# EAGLE design SkinProc_v0_1b_sensors (EAGLE 7.2.0)
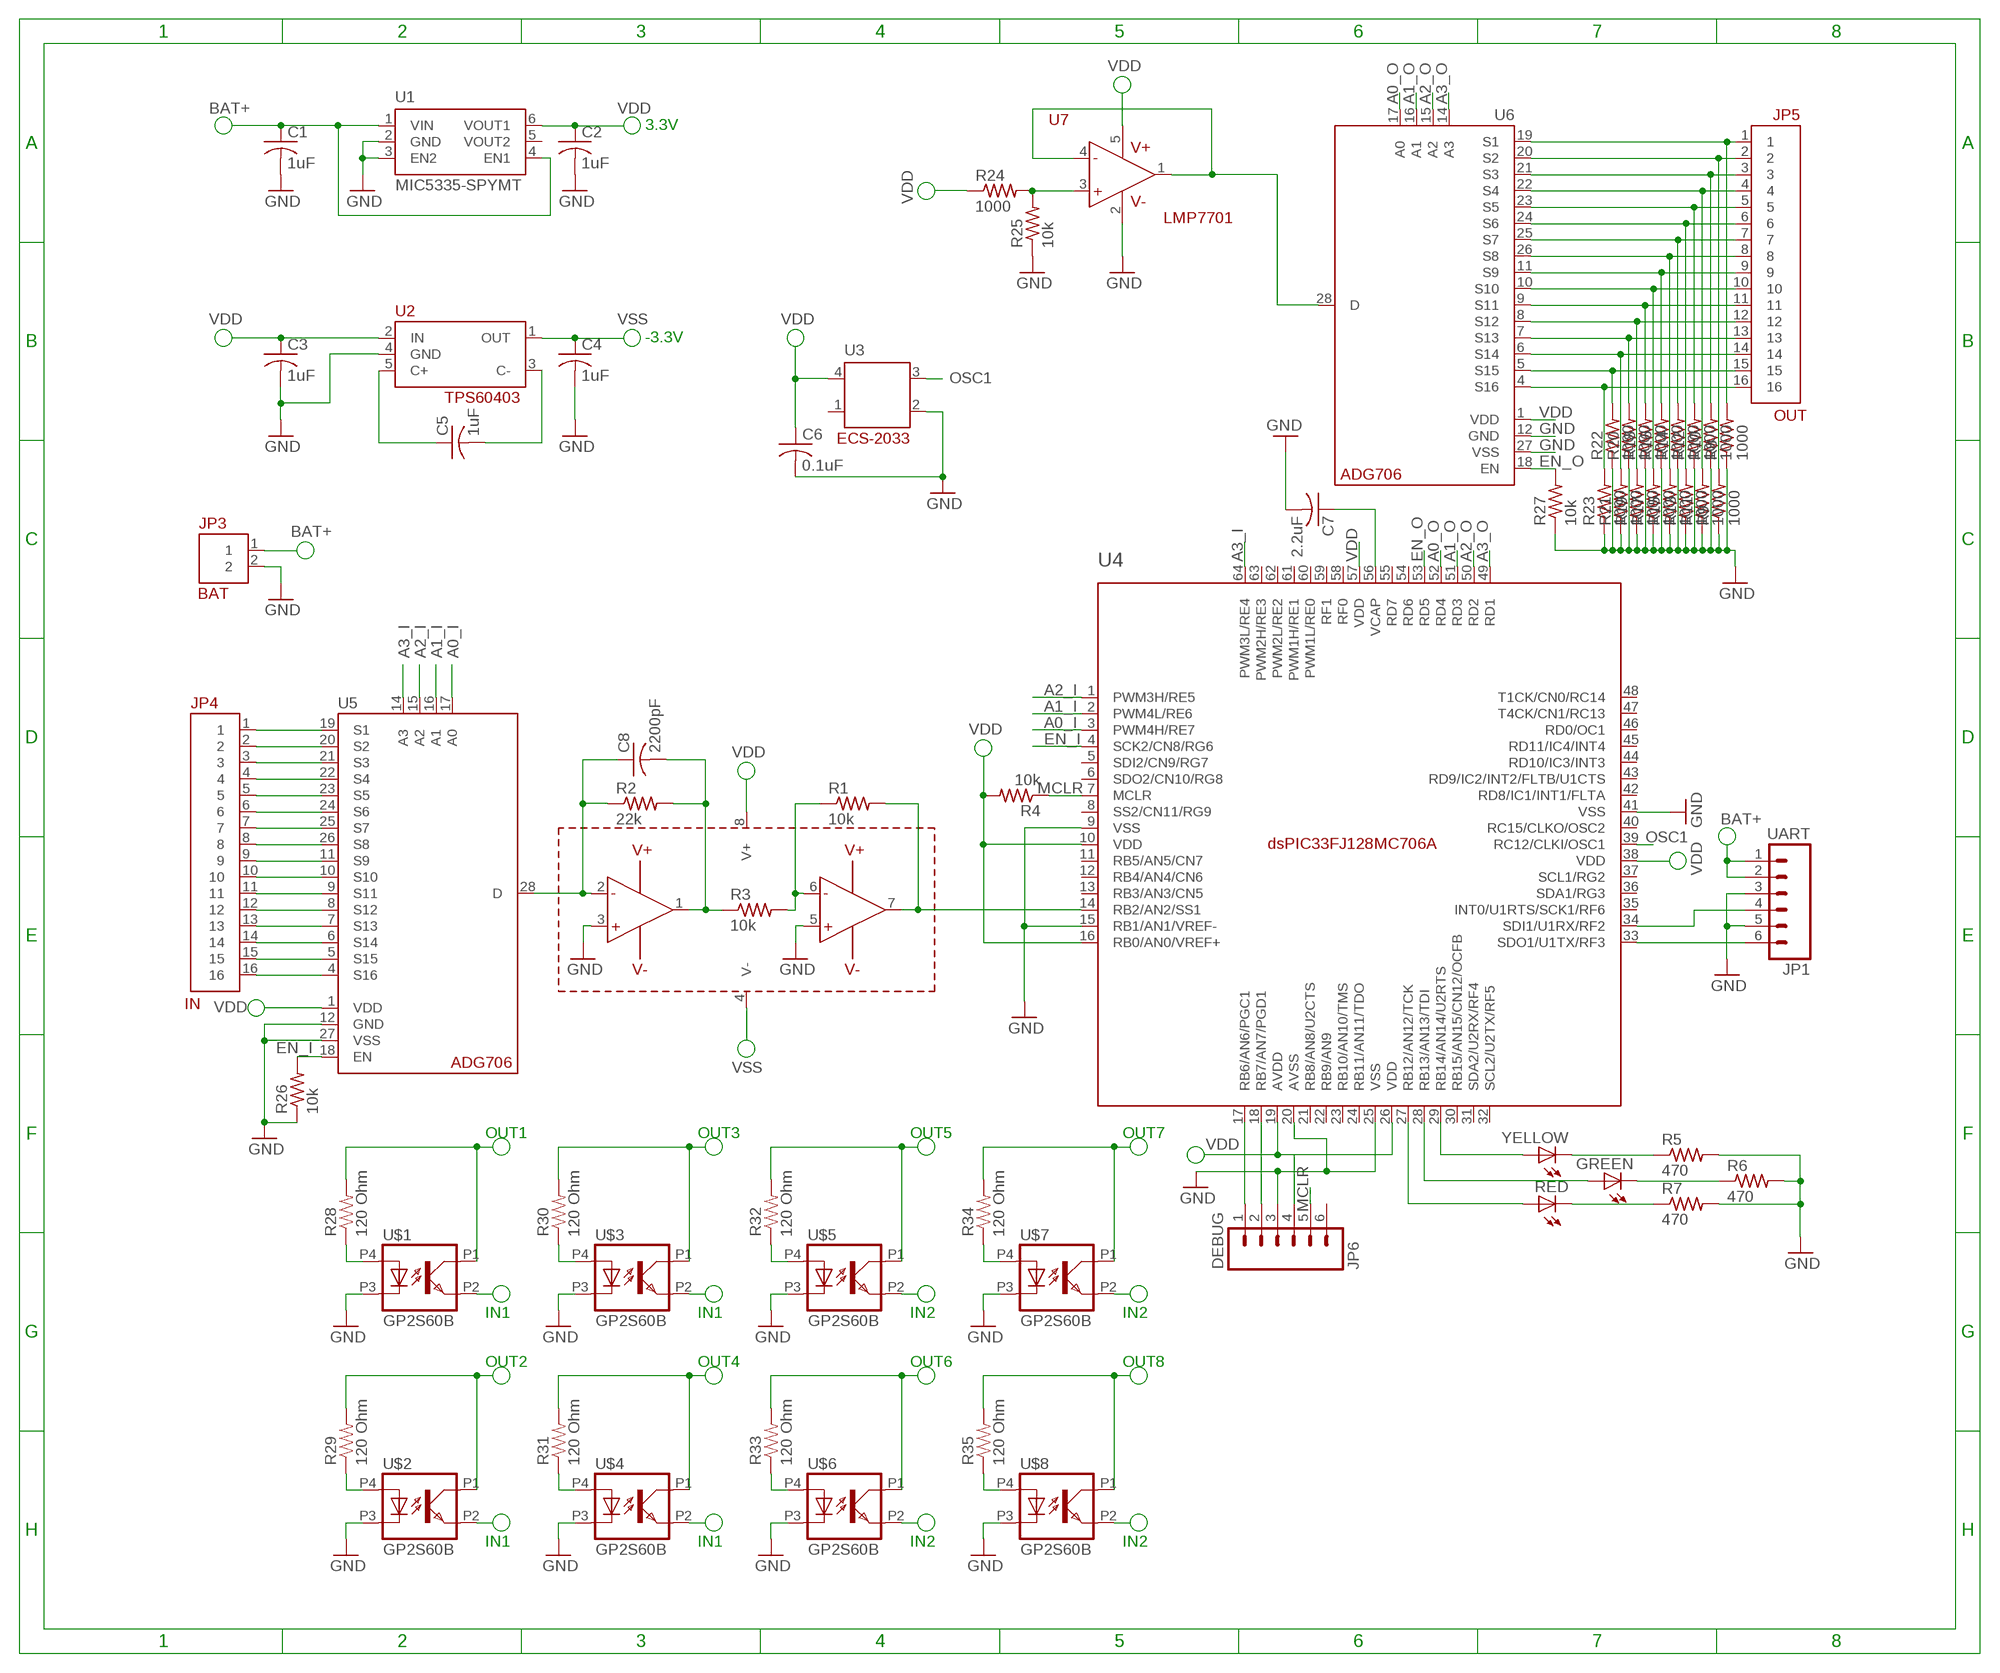
[diagram p0: schematic, sheet 1]

## Parts
C1  1uF  C-USC0402  [C0402]
C2  1uF  C-USC0402  [C0402]
C3  1uF  C-USC0402  [C0402]
C4  1uF  C-USC0402  [C0402]
C5  1uF  C-USC0402  [C0402]
C6  0.1uF  C-USC0402  [C0402]
C7  2.2uF  C-USC0402  [C0402]
C8  2200pF  C-USC0402  [C0402]
GREEN  LEDCHIP-LED0603  [CHIP-LED0603]
JP1  UART  MOLEX_503480-0600  [MOLEX_503480-0600]
JP3  BAT  2_PAD  [2_PAD]
JP4  IN  16_PAD  [16_PAD]
JP5  OUT  16_PAD  [16_PAD]
JP6  DEBUG  MOLEX_503480-0600  [MOLEX_503480-0600]
R1  10k  R-US_R0402  [R0402]
R2  22k  R-US_R0402  [R0402]
R3  10k  R-US_R0402  [R0402]
R4  10k  R-US_R0402  [R0402]
R5  470  R-US_R0402  [R0402]
R6  470  R-US_R0402  [R0402]
R7  470  R-US_R0402  [R0402]
R8  1000  R-US_R0402  [R0402]
R9  1000  R-US_R0402  [R0402]
R10  1000  R-US_R0402  [R0402]
R11  1000  R-US_R0402  [R0402]
R12  1000  R-US_R0402  [R0402]
R13  1000  R-US_R0402  [R0402]
R14  1000  R-US_R0402  [R0402]
R15  1000  R-US_R0402  [R0402]
R16  1000  R-US_R0402  [R0402]
R17  1000  R-US_R0402  [R0402]
R18  1000  R-US_R0402  [R0402]
R19  1000  R-US_R0402  [R0402]
R20  1000  R-US_R0402  [R0402]
R21  1000  R-US_R0402  [R0402]
R22  1000  R-US_R0402  [R0402]
R23  1000  R-US_R0402  [R0402]
R24  1000  R-US_R0402  [R0402]
R25  10k  R-US_R0402  [R0402]
R26  10k  R-US_R0402  [R0402]
R27  10k  R-US_R0402  [R0402]
R28  120 Ohm  RESISTOR0402-RES  [0402-RES]
R29  120 Ohm  RESISTOR0402-RES  [0402-RES]
R30  120 Ohm  RESISTOR0402-RES  [0402-RES]
R31  120 Ohm  RESISTOR0402-RES  [0402-RES]
R32  120 Ohm  RESISTOR0402-RES  [0402-RES]
R33  120 Ohm  RESISTOR0402-RES  [0402-RES]
R34  120 Ohm  RESISTOR0402-RES  [0402-RES]
R35  120 Ohm  RESISTOR0402-RES  [0402-RES]
RED  LEDCHIP-LED0603  [CHIP-LED0603]
U1  MIC5335-SPYMT  MIC5320-JGYML  [MLF-6]
U2  TPS60403  [SOT23-DBV]
U3  OSCILLATORS  [OSCILLATOR-SMD]
U4  DSPIC33FJ128MC706-I/PT  [TQFP64]
U5  ADG706  [TSSOP28]
U6  ADG706  [TSSOP28]
U7  LMP7701  NATIONAL_OP_AMP_SINGLE  [SOT23-DBV]
U8  NATIONAL_OP_AMP  [SO08]
U$1  GP2S60B  [4-SMD]
U$2  GP2S60B  [4-SMD]
U$3  GP2S60B  [4-SMD]
U$4  GP2S60B  [4-SMD]
U$5  GP2S60B  [4-SMD]
U$6  GP2S60B  [4-SMD]
U$7  GP2S60B  [4-SMD]
U$8  GP2S60B  [4-SMD]
YELLOW  LEDCHIP-LED0603  [CHIP-LED0603]

## Nets
A0_I: U4.3(PWM4H/RE7) U5.17(A0)
A0_O: U4.52(RD4) U6.17(A0)
A1_I: U4.2(PWM4L/RE6) U5.16(A1)
A1_O: U4.51(RD3) U6.16(A1)
A2_I: U4.1(PWM3H/RE5) U5.15(A2)
A2_O: U4.50(RD2) U6.15(A2)
A3_I: U4.64(PWM3L/RE4) U5.14(A3)
A3_O: U4.49(RD1) U6.14(A3)
BAT+: C1.1 JP1.1 JP1.2 JP3.1 U1.1(VIN) U1.4(EN1)
EN_I: R26.2 U4.4(SCK2/CN8/RG6) U5.18(EN)
EN_O: R27.2 U4.53(RD5) U6.18(EN)
GND: C1.2 C2.2 C3.2 C4.2 C6.2 C7.2 JP1.3 JP1.5 JP3.2 JP6.3 R5.2 R6.2 R7.2 R8.1 R9.1 R10.1 R11.1 R12.1 R13.1 R14.1 R15.1 R16.1 R17.1 R18.1 R19.1 R20.1 R21.1 R22.1 R23.1 R25.1 R26.1 R27.1 U1.2(GND) U1.3(EN2) U2.4(GND) U3.2(GND) U4.9(VSS) U4.15(RB1/AN1/VREF-) U4.20(AVSS) U4.25(VSS) U4.41(VSS) U5.12(GND) U5.27(VSS) U6.12(GND) U6.27(VSS) U7.2(V-) U8.3(+A) U8.5(+B) U$1.P3 U$2.P3 U$3.P3 U$4.P3 U$5.P3 U$6.P3 U$7.P3 U$8.P3
IN1: JP4.1 U5.19(S1) U$1.P2 U$2.P2 U$3.P2 U$4.P2
IN2: JP4.2 U5.20(S2) U$5.P2 U$6.P2 U$7.P2 U$8.P2
IN3: JP4.3 U5.21(S3)
IN4: JP4.4 U5.22(S4)
IN5: JP4.5 U5.23(S5)
IN6: JP4.6 U5.24(S6)
IN7: JP4.7 U5.25(S7)
IN8: JP4.8 U5.26(S8)
IN9: JP4.9 U5.11(S9)
IN10: JP4.10 U5.10(S10)
IN11: JP4.11 U5.9(S11)
IN12: JP4.12 U5.8(S12)
IN13: JP4.13 U5.7(S13)
IN14: JP4.14 U5.6(S14)
IN15: JP4.15 U5.5(S15)
IN16: JP4.16 U5.4(S16)
MCLR: JP6.5 R4.1 U4.7(MCLR)
N$1: R1.2 U4.14(RB2/AN2/SS1) U8.7(VOUTB)
N$2: C5.1 U2.5(C+)
N$3: C7.1 U4.56(VCAP)
N$4: C5.2 U2.3(C-)
N$5: R5.1 YELLOW.C
N$6: R28.1 U$1.P4
N$7: JP6.1 U4.17(RB6/AN6/PGC1)
N$8: R1.1 R3.2 U8.6(-B)
N$9: C8.2 R2.2 R3.1 U8.1(VOUTA)
N$10: JP6.2 U4.18(RB7/AN7/PGD1)
N$11: C8.1 R2.1 U5.28(D) U8.2(-A)
N$12: JP1.4 U4.34(SDI1/U1RX/RF2)
N$13: JP1.6 U4.33(SDO1/U1TX/RF3)
N$14: R7.1 RED.C
N$15: GREEN.C R6.1
N$16: U4.29(RB14/AN14/U2RTS) YELLOW.A
N$17: GREEN.A U4.28(RB13/AN13/TDI)
N$18: RED.A U4.27(RB12/AN12/TCK)
N$19: R29.1 U$2.P4
N$20: R30.1 U$3.P4
N$21: R31.1 U$4.P4
N$23: U6.28(D) U7.1(VOUT) U7.4(-)
N$25: R32.1 U$5.P4
N$26: R33.1 U$6.P4
N$27: R34.1 U$7.P4
N$28: R35.1 U$8.P4
N$30: R24.2 R25.2 U7.3(+)
OSC1: U3.3(OUT) U4.39(RC12/CLKI/OSC1)
OUT1: JP5.1 R8.2 R28.2 U6.19(S1) U$1.P1
OUT2: JP5.2 R9.2 R29.2 U6.20(S2) U$2.P1
OUT3: JP5.3 R10.2 R30.2 U6.21(S3) U$3.P1
OUT4: JP5.4 R11.2 R31.2 U6.22(S4) U$4.P1
OUT5: JP5.5 R12.2 R32.2 U6.23(S5) U$5.P1
OUT6: JP5.6 R13.2 R33.2 U6.24(S6) U$6.P1
OUT7: JP5.7 R14.2 R34.2 U6.25(S7) U$7.P1
OUT8: JP5.8 R15.2 R35.2 U6.26(S8) U$8.P1
OUT9: JP5.9 R16.2 U6.11(S9)
OUT10: JP5.10 R17.2 U6.10(S10)
OUT11: JP5.11 R18.2 U6.9(S11)
OUT12: JP5.12 R19.2 U6.8(S12)
OUT13: JP5.13 R20.2 U6.7(S13)
OUT14: JP5.14 R21.2 U6.6(S14)
OUT15: JP5.15 R22.2 U6.5(S15)
OUT16: JP5.16 R23.2 U6.4(S16)
VDD: C2.1 C3.1 C6.1 JP6.4 R4.2 R24.1 U1.6(VOUT1) U2.2(IN) U3.4(VDD) U4.10(VDD) U4.16(RB0/AN0/VREF+) U4.19(AVDD) U4.26(VDD) U4.38(VDD) U4.57(VDD) U5.1(VDD) U6.1(VDD) U7.5(V+) U8.8(V+)
VSS: C4.1 U2.1(OUT) U8.4(V-)
Unconnected: JP6.6 U1.5(VOUT2) U3.1(NC) U4.5(SDI2/CN9/RG7) U4.6(SDO2/CN10/RG8) U4.8(SS2/CN11/RG9) U4.11(RB5/AN5/CN7) U4.12(RB4/AN4/CN6) U4.13(RB3/AN3/CN5) U4.21(RB8/AN8/U2CTS) U4.22(RB9/AN9) U4.23(RB10/AN10/TMS) U4.24(RB11/AN11/TDO) U4.30(RB15/AN15/CN12/OCFB) U4.31(SDA2/U2RX/RF4) U4.32(SCL2/U2TX/RF5) U4.35(INT0/U1RTS/SCK1/RF6) U4.36(SDA1/RG3) U4.37(SCL1/RG2) U4.40(RC15/CLKO/OSC2) U4.42(RD8/IC1/INT1/FLTA) U4.43(RD9/IC2/INT2/FLTB/U1CTS) U4.44(RD10/IC3/INT3) U4.45(RD11/IC4/INT4) U4.46(RD0/OC1) U4.47(T4CK/CN1/RC13) U4.48(T1CK/CN0/RC14) U4.54(RD6) U4.55(RD7) U4.58(RF0) U4.59(RF1) U4.60(PWM1L/RE0) U4.61(PWM1H/RE1) U4.62(PWM2L/RE2) U4.63(PWM2H/RE3)

## Notes on the sheet
- 3.3V
- -3.3V
- OUT1 | OUT3 | OUT5 | OUT7
- IN1 | IN1 | IN2 | IN2
- OUT2 | OUT4 | OUT6 | OUT8
- IN1 | IN1 | IN2 | IN2

## Library data of the parts
C1-C8 = rcl:C-US: CAPACITOR, American symbol
GREEN RED YELLOW = led:LED: LED OSRAM: - CHIPLED LG R971, LG N971, LY N971, LG Q971, LY Q971, LO R971, LY R971 LH N974, LH R974 LS Q976, LO Q976, LY Q976 LO Q996 - Hyper CHIPLED LW Q18S LB Q993, LB Q99A, LB R99A - SideLED LS A670, LO A670, LY A670, LG A670, LP A670 LB A673, LV A673, LT A673, LW A673 LH A674 LY A675 LS A676, LA A676, LO A676, LY A676, LW A676 LS A679, LY A679, LG A679 - Hyper Micro SIDELED® LS Y876, LA Y876, LO Y876, LY Y876 LT Y87S - SmartLED LW L88C, LW L88S LB L89C, LB L89S, LG L890 LS L89K, LO L89K, LY L89K LS L896, LA L896, LO L896, LY L896 - TOPLED LS T670, LO T670, LY T670, LG T670, LP T670 LSG T670, LSP T670, LSY T670, LOP T670, LYG T670 LG T671, LOG T671, LSG T671 LB T673, LV T673, LT T673, LW T673 LH T674 LS T676, LA T676, LO T676, LY T676, LB T676, LH T676, LSB T676, LW T676 LB T67C, LV T67C, LT T67C, LS T67K, LO T67K, LY T67K, LW E67C LS E67B, LA E67B, LO E67B, LY E67B, LB E67C, LV E67C, LT E67C LW T67C LS T679, LY T679, LG T679 LS T770, LO T770, LY T770, LG T770, LP T770 LB T773, LV T773, LT T773, LW T773 LH T774 LS E675, LA E675, LY E675, LS T675 LS T776, LA T776, LO T776, LY T776, LB T776 LHGB T686 LT T68C, LB T68C - Hyper Mini TOPLED® LB M676 - Mini TOPLED Santana® LG M470 LS M47K, LO M47K, LY M47K Source: http://www.osram.convergy.de LUXEON: - LUMILED® LXK2-PW12-R00, LXK2-PW12-S00, LXK2-PW14-U00, LXK2-PW14-V00 LXK2-PM12-R00, LXK2-PM12-S00, LXK2-PM14-U00 LXK2-PE12-Q00, LXK2-PE12-R00, LXK2-PE12-S00, LXK2-PE14-T00, LXK2-PE14-U00 LXK2-PB12-K00, LXK2-PB12-L00, LXK2-PB12-M00, LXK2-PB14-N00, LXK2-PB14-P00, LXK2-PB14-Q00 LXK2-PR12-L00, LXK2-PR12-M00, LXK2-PR14-Q00, LXK2-PR14-R00 LXK2-PD12-Q00, LXK2-PD12-R00, LXK2-PD12-S00 LXK2-PH12-R00, LXK2-PH12-S00 LXK2-PL12-P00, LXK2-PL12-Q00, LXK2-PL12-R00 Source: www.luxeon.com KINGBRIGHT: KA-3528ASYC Source: www.kingbright.com
JP1 JP6 = biomimetic:MOLEX_503480-0600
JP3 = SkinProc:2_PAD
JP4 JP5 = SkinProc:16_PAD
R1-R27 = rcl:R-US_: RESISTOR, American symbol
R28-R35 = biomimetic:RESISTOR: Resistor Basic schematic elements and footprints for 0603, 1206, and PTH resistors.
U1 = stan:MIC5320: MIC5320 High Performance Dual 150mA Voltage Regulator Package: NOT VERIFIED
U2 = SkinProc:TPS60403
U3 = stan:OSCILLATOR
U4 = stan:DSPIC33FJ128MC706: Microchip dsPIC33FJ128MC706
U5 U6 = SkinProc:ADG706: Analog Devices ADG706 16:1 Analog Mux
U7 = SkinProc:NATIONAL_OP_AMP_SINGLE
U8 = SkinProc:NATIONAL_OP_AMP: National Semiconductor LM6144/LMP7702 OP AMP
U$1-U$8 = jgoldberg:GP2S60B

## Board
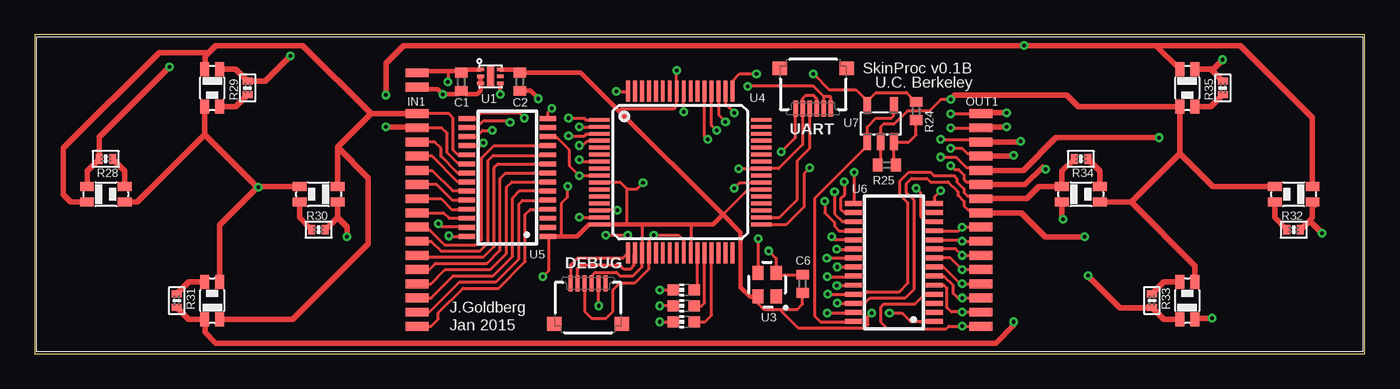
[diagram p1: board, top side]
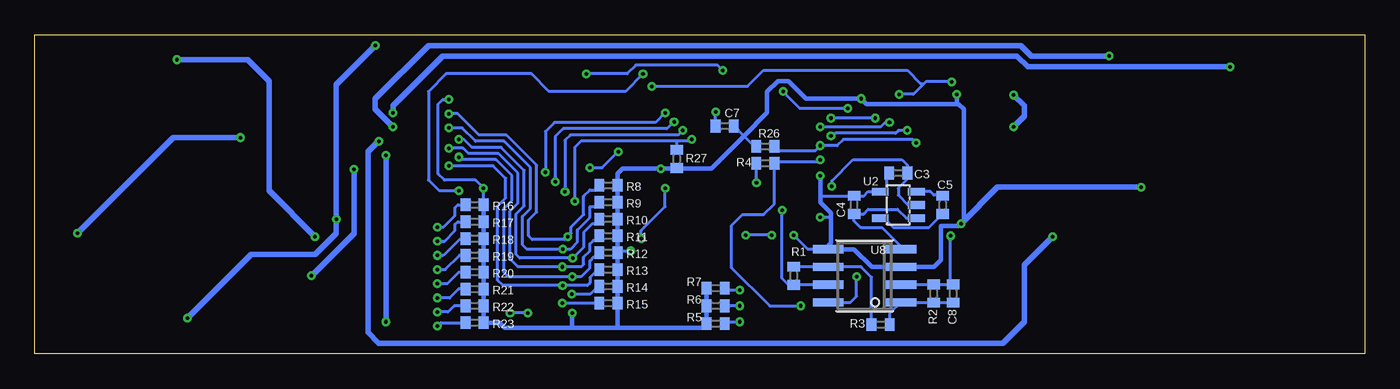
[diagram p2: board, bottom side, seen from below]

Size 95.25 x 22.86 mm. Coordinates in mm from the lower left corner, seen from the top.
Outline: 0,0 95.25,0 95.25,22.86 0,22.86 0,0
Copper layers (1*16): Top 2mil / dielectric 27mil / Bottom 2mil
Design rules "advancedcircuits-standard-biomimetic": minimum track width 5mil, minimum drill 10mil, track to track 5mil, track to pad 5mil, pad to pad 5mil, via to via 5mil, smd to smd 5mil, copper to edge 0.256540625mm, drill to drill 0.256540625mm, minimum pad ring 0.180340625mm, minimum via ring 0.180340625mm, stop-mask expansion 2mil, vias tented up to drill 0mil, thermal gap 10mil

### Footprints (pad centres in the part's own frame; a part is rotated, then mirrored left to right if it is on the bottom)
C0402 = smd 0.7 x 0.9: 1 -0.65,0; 2 0.65,0
CHIP-LED0603 = smd 0.8 x 0.8: A 0,-0.75; C 0,0.75
MOLEX_503480-0600 = smd 0.3 x 1.15: 1 -1.25,1.725; 2 -0.75,1.725; 3 -0.25,1.725; 4 0.25,1.725; 5 0.75,1.725; 6 1.25,1.725 | smd 1.035 x 1: L -2.408,-1.15; R 2.408,-1.15
2_PAD = smd 1.651 x 0.635: 1 0.953,1.46; 2 0.953,0.445
16_PAD = smd 1.651 x 0.635: 1 0.953,15.684; 2 0.953,14.668; 3 0.953,13.652; 4 0.953,12.636; 5 0.953,11.62; 6 0.953,10.604; 7 0.953,9.588; 8 0.953,8.572; 9 0.953,7.556; 10 0.953,6.54; 11 0.953,5.524; 12 0.953,4.508; 13 0.953,3.493; 14 0.953,2.477; 15 0.953,1.46; 16 0.953,0.445
R0402 = smd 0.7 x 0.9: 1 -0.65,0; 2 0.65,0
0402-RES = smd 0.508 x 0.711: 1 -0.483,0; 2 0.483,0
MLF-6 = smd 0.25 x 0.5: 1 -0.5,-0.7; 2 0,-0.7; 3 0.5,-0.7; 4 0.5,0.7; 5 0,0.7; 6 -0.5,0.7 | smd 1.4 x 0.5: P$1 0,0
SOT23-DBV = smd 0.55 x 1.2: 1 -0.95,-1.3; 2 0,-1.3; 3 0.95,-1.3; 4 0.95,1.3; 5 -0.95,1.3
OSCILLATOR-SMD = smd 1 x 0.8: 1 -0.85,-0.65; 2 0.85,-0.65; 3 0.85,0.65; 4 -0.85,0.65
TQFP64 = smd 1.5 x 0.28: 1 -5.8,3.75; 2 -5.8,3.25; 3 -5.8,2.75; 4 -5.8,2.25; 5 -5.8,1.75; 6 -5.8,1.25; 7 -5.8,0.75; 8 -5.8,0.25; 9 -5.8,-0.25; 10 -5.8,-0.75; 11 -5.8,-1.25; 12 -5.8,-1.75; 13 -5.8,-2.25; 14 -5.8,-2.75; 15 -5.8,-3.25; 16 -5.8,-3.75; 33 5.8,-3.75; 34 5.8,-3.25; 35 5.8,-2.75; 36 5.8,-2.25; 37 5.8,-1.75; 38 5.8,-1.25; 39 5.8,-0.75; 40 5.8,-0.25; 41 5.8,0.25; 42 5.8,0.75; 43 5.8,1.25; 44 5.8,1.75; 45 5.8,2.25; 46 5.8,2.75; 47 5.8,3.25; 48 5.8,3.75 | smd 0.28 x 1.5: 17 -3.75,-5.8; 18 -3.25,-5.8; 19 -2.75,-5.8; 20 -2.25,-5.8; 21 -1.75,-5.8; 22 -1.25,-5.8; 23 -0.75,-5.8; 24 -0.25,-5.8; 25 0.25,-5.8; 26 0.75,-5.8; 27 1.25,-5.8; 28 1.75,-5.8; 29 2.25,-5.8; 30 2.75,-5.8; 31 3.25,-5.8; 32 3.75,-5.8; 49 3.75,5.8; 50 3.25,5.8; 51 2.75,5.8; 52 2.25,5.8; 53 1.75,5.8; 54 1.25,5.8; 55 0.75,5.8; 56 0.25,5.8; 57 -0.25,5.8; 58 -0.75,5.8; 59 -1.25,5.8; 60 -1.75,5.8; 61 -2.25,5.8; 62 -2.75,5.8; 63 -3.25,5.8; 64 -3.75,5.8
TSSOP28 = smd 0.35 x 1.2: 1 -4.225,-2.9; 2 -3.575,-2.9; 3 -2.925,-2.9; 4 -2.275,-2.9; 5 -1.625,-2.9; 6 -0.975,-2.9; 7 -0.325,-2.9; 8 0.325,-2.9; 9 0.975,-2.9; 10 1.625,-2.9; 11 2.275,-2.9; 12 2.925,-2.9; 13 3.575,-2.9; 14 4.225,-2.9; 15 4.225,2.9; 16 3.575,2.9; 17 2.925,2.9; 18 2.275,2.9; 19 1.625,2.9; 20 0.975,2.9; 21 0.325,2.9; 22 -0.325,2.9; 23 -0.975,2.9; 24 -1.625,2.9; 25 -2.275,2.9; 26 -2.925,2.9; 27 -3.575,2.9; 28 -4.225,2.9
SO08 = smd 0.6 x 2.2: 1 -1.905,-2.6; 2 -0.635,-2.6; 3 0.635,-2.6; 4 1.905,-2.6; 5 1.905,2.6; 6 0.635,2.6; 7 -0.635,2.6; 8 -1.905,2.6
4-SMD = smd 1 x 0.65: P1 -1.35,0.55; P2 -1.35,-0.55; P3 1.35,-0.55; P4 1.35,0.55

### Placement (x,y rotation side)
C1  30.54,19.49 270 top
C2  34.73,19.49 270 top
C3  33.4,12.95 180 bottom
C4  36.58,10.67 90 bottom
C5  30.23,10.67 90 bottom
C6  54.99,5.02 90 top
C7  45.85,16.32 0 bottom
C8  29.46,4.32 270 bottom
GREEN  46.48,3.43 90 top
JP1  55.75,19.3 180 top
JP3  26.42,18.67 0 top
JP4  26.42,1.52 0 top
JP5  66.8,1.52 0 top
JP6  39.62,3.3 0 top
R1  40.89,5.59 270 bottom
R2  30.86,4.32 270 bottom
R3  34.67,2.1 180 bottom
R4  42.93,13.65 180 bottom
R5  46.48,2.16 180 bottom
R6  46.48,3.43 180 bottom
R7  46.48,4.7 180 bottom
R8  54.17,12.06 180 bottom
R9  54.17,10.86 180 bottom
R10  54.17,9.65 180 bottom
R11  54.17,8.45 180 bottom
R12  54.17,7.24 180 bottom
R13  54.17,6.03 180 bottom
R14  54.17,4.83 180 bottom
R15  54.17,3.62 180 bottom
R16  63.75,10.67 180 bottom
R17  63.75,9.46 180 bottom
R18  63.75,8.26 180 bottom
R19  63.75,7.05 180 bottom
R20  63.75,5.84 180 bottom
R21  63.75,4.64 180 bottom
R22  63.75,3.43 180 bottom
R23  63.75,2.22 180 bottom
R24  63.12,17.4 270 top
R25  61.02,13.53 0 top
R26  42.93,14.86 0 bottom
R27  49.28,13.97 90 bottom
R28  5.08,13.97 180 top
R29  15.24,19.05 90 top
R30  20.32,8.89 0 top
R31  10.16,3.81 270 top
R32  90.17,8.89 0 top
R33  80.01,3.81 270 top
R34  74.93,13.97 180 top
R35  85.09,19.05 90 top
RED  46.48,4.57 90 top
U1  32.64,19.88 270 top
U2  33.4,10.67 90 bottom
U3  52.45,4.95 90 top
U4  46.23,13.02 0 top
U5  33.85,12.64 90 top
U6  61.53,6.54 90 top
U7  60.58,16.51 0 top
U8  35.81,5.59 90 bottom
U$1  5.08,11.43 0 top
U$2  12.7,19.05 270 top
U$3  20.32,11.43 180 top
U$4  12.7,3.81 90 top
U$5  90.17,11.43 180 top
U$6  82.55,3.81 90 top
U$7  74.93,11.43 0 top
U$8  82.55,19.05 270 top
YELLOW  46.48,2.29 90 top

### Tracks (layer width: path | path; a pad name or v marks a point on that pad's centre or on a via)
A0_I  (via drill 0.25)
  Top 0.203: U5.17 31.63,15.56 32.07,16 v32.77,16 | U4.3 40.41,15.75 39.5,15.75 39.37,15.62 v38.23,15.62
  Bottom 0.203: v32.77,16 33.4,16 33.59,15.81 37.91,15.81 38.1,15.62 v38.23,15.62
A0_O  (via drill 0.25)
  Top 0.203: U6.17 57.84,9.47 57.28,10.03 v57.28,11.62 | U4.52 48.48,16.36 v48.83,16
  Bottom 0.203: v48.83,16 49.15,15.68 56.9,15.68 57.28,15.3 v57.28,11.62
A1_I  (via drill 0.25)
  Top 0.203: U5.16 31.64,16.21 32.13,16.7 33.91,16.7 v34.04,16.57 | v38.99,16.26 40.42,16.26 U4.2
  Bottom 0.203: v34.04,16.57 34.35,16.57 34.67,16.26 v38.99,16.26
A1_O  (via drill 0.25)
  Top 0.203: U6.16 57.96,10.12 57.72,10.35 57.72,11.11 57.98,11.37 v57.98,12.32 | U4.51 48.98,17.12 v49.47,16.64
  Bottom 0.203: v57.98,12.32 57.98,15.56 57.4,16.13 49.97,16.13 v49.47,16.64
A2_I  (via drill 0.25)
  Top 0.203: U5.15 31.59,16.86 32,17.27 34.67,17.27 v35.05,16.89 | v38.23,16.89 39.37,16.89 39.5,16.76 U4.1
  Bottom 0.203: v35.05,16.89 v38.23,16.89
A2_O  (via drill 0.25)
  Top 0.203: U6.15 58.67,10.81 v58.67,13.02 | U4.50 49.47,18.81 49.47,17.91 v50.1,17.27
  Bottom 0.203: v58.67,13.02 58.67,15.94 58.04,16.57 50.8,16.57 v50.1,17.27
A3_I  (via drill 0.25)
  Top 0.203: U5.14 36.74,17.31 v37.02,17.59 | v41.66,18.8 42.46,18.8 U4.64
  Bottom 0.203: v37.02,17.59 40.45,17.59 v41.66,18.8
A3_O  (via drill 0.25)
  Top 0.203: U6.14 64.43,11.22 v64.9,11.68 | v51.69,20.07 50.48,20.07 49.97,19.56 U4.49
  Bottom 0.203: v64.9,11.68 66.29,11.68 67.06,12.45 67.06,18.8 65.79,20.07 59.69,20.07 58.42,18.8 52.96,18.8 v51.69,20.07
BAT+  (via drill 0.25)
  Top 0.203: U1.1 | U1.4 v33.34,18.61 | 29.59,20.26 v29.59,19.49 | JP1.1 57.02,17.6 57.02,18.41 56.52,18.41 | 56.52,18.41 55.75,19.18 v51.05,19.18 | JP1.2 56.52,17.59 56.52,18.41
  Top 0.305: U1.1 30.77,20.38 C1.1 | C1.1 30.53,20.26 | JP3.1 27.69,20.13 27.81,20.26 29.59,20.26 30.43,20.26 C1.1
  Bottom 0.203: v33.34,18.61 32.32,18.61 31.56,19.37 | 31.56,19.37 31.43,19.49 v29.59,19.49 | v51.05,19.18 44.2,19.18 43.05,20.32 32.77,20.32 31.81,19.37 31.56,19.37
EN_I  (via drill 0.25)
  Top 0.203: U5.18 31.93,14.91 v32.13,15.11 | v38.99,14.92 39.24,14.92 39.56,15.24 40.4,15.24 U4.4
  Bottom 0.203: v32.13,15.11 32.38,15.37 37.34,15.37 37.78,14.92 v38.99,14.92 39.37,14.54 42.04,14.54 42.28,14.78 R26.2
EN_O  (via drill 0.25)
  Top 0.203: 48.01,19.18 47.98,19.15 U4.53 47.98,15.59 v48.2,15.37 | U6.18 57.6,8.82 57.28,9.14 57.28,9.4 56.58,10.1 v56.58,10.92
  Bottom 0.203: v48.2,15.37 48.32,15.24 49.34,15.24 | 49.34,15.24 56.13,15.24 56.58,14.8 v56.58,10.92 | R27.2 49.28,15.18 49.34,15.24
GND  (via drill 0.25)
  Top 0.203: U6.27 58.59,2.92 v56.77,2.92 | U6.12 63.81,9.47 63.44,9.84 63.44,11.56 v63.12,11.87 | R25.1 60.58,13.73 U7.2 60.58,16.26 60.77,16.45 61.53,16.45 62.48,17.4 64.07,17.4 64.9,18.22 v65.6,18.22 | C6.2 53.24,5.67 U3.2 53.1,6.84 v52.58,7.37 | U4.15 39,9.77 v38.99,9.78 | U4.9 v38.99,12.77 v38.99,12.76 38.29,13.46 38.29,14.61 37.33,15.56 U5.12 | U4.25 46.48,8.13 46.1,8.51 v44.32,8.51 44.01,8.19 44.01,7.19 U4.20 44.01,7.22 44.01,6.1 42.99,5.08 41.91,5.08 41.4,4.57 41.4,3.05 40.89,2.54 39.88,2.54 39.37,3.04 JP6.3 | v40.89,8.51 v42.48,8.51 | v50.42,13.27 U4.41 53.27,13.27 54.99,14.99 54.99,17.57 JP1.5 54.99,17.59 54.99,18.29 55.24,18.54 55.75,18.54 56,18.29 JP1.3 | v28.89,9.34 29.1,9.12 30.88,9.12 U5.27
  Top 0.305: C2.2 35.51,18.84 v36.07,18.29 | JP3.2 27.75,19.11 27.88,18.99 28.83,18.99 v29.21,18.61 30.3,18.61 C1.2 30.62,18.84 30.86,18.61 31.69,18.61 31.94,18.86 U1.3 U1.2
  Top 0.406: U$1.P3 7.32,10.88 12.15,15.71 | 12.15,15.71 U$2.P3 | 16,11.98 U$3.P3 16.04,11.98 v16,11.94 | 16,11.98 15.88,11.98 12.15,15.71 | U$4.P3 13.25,9.23 16,11.98 | U$6.P3 83.1,6.31 78.53,10.88 | 78.53,10.88 U$7.P3 | 78.53,10.88 82,14.35 | U$5.P3 84.37,11.98 82,14.35 | v65.6,18.22 65.91,18.54 73.91,18.54 74.76,17.7 U$8.P3 82,14.35
  Bottom 0.203: R16.1 63.12,10.68 v63.12,11.87 63.69,12.45 65.91,12.45 66.36,12.89 66.36,17.91 66.04,18.22 v65.6,18.22 | U2.4 34.42,11.62 34.23,11.81 34.23,12.78 C3.2 | U2.4 34.6,11.62 | U2.4 35.56,11.62 35.88,11.3 36.56,11.3 C4.2 38.91,11.32 38.99,11.24 | 38.23,9.78 v38.99,9.78 | v42.48,8.51 v44.32,8.51 | U8.5 39.88,7.49 v40.89,8.51 | v52.58,7.37 53.39,7.37 R12.1 | C7.2 45.15,16.32 44.45,15.62 43.69,14.86 R26.1
  Bottom 0.305: R16.1 R17.1 R18.1 R19.1 R20.1 R21.1 R22.1 R23.1 61.98,2.22 61.59,1.84 56.77,1.84 | 56.77,1.84 v56.77,2.92 | R12.1 R11.1 R10.1 R9.1 R8.1 53.52,12.9 53.15,13.27 v50.42,13.27 49.59,13.27 49.55,13.32 R27.1 49.23,13.27 46.8,13.27 44.45,15.62 42.8,17.27 42.8,18.8 42.04,19.56 41.27,19.56 40.01,18.29 v36.07,18.29 35.69,17.91 29.21,17.91 | v38.99,12.76 38.99,11.24 38.99,10.86 38.23,10.1 38.23,9.78 38.23,7.94 38.41,7.75 U8.5 36.58,7.49 35.31,6.22 U8.3 30.86,6.22 30.35,6.73 30.35,9.14 29.08,9.14 v28.89,9.34 28.7,9.53 28.7,17.53 29.08,17.91 29.21,17.91 | 29.21,17.91 v29.21,18.61 | R7.2 R6.2 R5.2 47.45,1.84 53.59,1.84 | R12.1 53.52,7.16 53.34,6.99 | 53.59,1.84 56.77,1.84 | R12.1 R13.1 R14.1 R15.1 53.53,3.6 53.53,1.91 53.59,1.84
  Bottom 0.406: v16,11.94 26.29,11.94 v28.89,9.34
IN1
  Top 0.203: JP4.1 29.65,17.21 29.97,16.89 29.97,14.61 30.35,14.22 30.91,14.22 U5.19
  Top 0.406: U$3.P2 21.67,14.81 | 21.67,14.81 24.07,17.21 | 24.07,17.21 JP4.1 | U$2.P2 12.19,20.44 12.19,21.34 12.45,21.59 | 12.45,21.59 12.95,22.1 19.18,22.1 24.07,17.21 | U$1.P2 2.58,10.88 2.03,11.43 2.03,14.73 8.89,21.59 12.45,21.59 | U$4.P2 18.46,2.46 23.88,7.87 23.88,12.61 21.67,14.81
IN2  (via drill 0.25)
  Top 0.203: JP4.2 29.15,16.19 29.53,15.81 29.53,14.41 30.35,13.59 30.92,13.59 U5.20
  Top 0.406: U$8.P2 80.3,22.1 | 80.3,22.1 v70.87,22.1 26.42,22.1 25.15,20.83 v25.15,18.54 | v25.15,16.26 27.3,16.26 JP4.2 | U$5.P2 91.52,16.94 86.36,22.1 80.3,22.1 | U$6.P2 83.18,2.54 v84.33,2.54 | U$7.P2 73.58,9.73 v73.66,9.65
  Bottom 0.406: v25.15,16.26 24.38,17.02 24.38,17.78 v25.15,18.54 | v70.87,22.1 73.66,19.3 v73.66,9.65 73.66,8.64 75.18,7.11 79.76,7.11 v84.33,2.54
IN3
  Top 0.203: JP4.3 28.64,15.18 29.08,14.73 29.08,14.16 30.29,12.95 30.94,12.95 U5.21
IN4
  Top 0.203: JP4.4 28.45,14.16 30.29,12.32 30.94,12.32 U5.22
IN5
  Top 0.203: JP4.5 28.45,13.14 29.91,11.68 30.92,11.68 U5.23
IN6
  Top 0.203: JP4.6 28.77,12.13 29.91,10.99 30.92,10.99 U5.24
IN7
  Top 0.203: JP4.7 29.08,11.11 29.84,10.35 30.93,10.35 U5.25
IN8
  Top 0.203: JP4.8 29.27,10.1 29.65,9.72 U5.26
IN9
  Top 0.203: U5.11 32.88,14.91 32,14.03 32,8.19 31.62,7.81 29.34,7.81 28.19,8.95 27.5,8.95 JP4.9
IN10
  Top 0.203: JP4.10 28.38,8.06 29.08,7.37 31.88,7.37 32.45,7.94 32.45,13.84 32.83,14.22 36.71,14.22 U5.10
IN11
  Top 0.203: U5.9 33.17,13.61 32.89,13.34 32.89,7.68 32.13,6.92 27.5,6.92 JP4.11
IN12
  Top 0.203: 27.3,6.03 JP4.12 28.26,6.03 28.7,6.48 32.38,6.48 33.34,7.43 33.34,12.57 33.72,12.95 36.74,12.95 U5.8
IN13
  Top 0.203: JP4.13 28.38,5.02 29.4,6.03 32.64,6.03 33.78,7.18 33.78,11.94 34.16,12.32 36.74,12.32 U5.7
IN14
  Top 0.203: JP4.14 28.38,4 29.97,5.59 32.83,5.59 34.23,6.99 34.23,11.18 34.73,11.68 36.72,11.68 U5.6
IN15
  Top 0.203: JP4.15 28.26,2.98 30.42,5.14 33.02,5.14 34.67,6.79 34.67,10.73 34.92,10.99 36.72,10.99 U5.5
IN16
  Top 0.203: JP4.16 28.38,1.97 28.89,2.48 28.89,2.92 30.67,4.7 33.21,4.7 35.12,6.6 35.12,9.97 35.5,10.35 36.73,10.35 U5.4
MCLR  (via drill 0.25)
  Top 0.203: v38.99,13.91 39.12,13.78 40.42,13.78 U4.7 | v40.39,3.43 40.37,3.44 JP6.5
  Bottom 0.203: 39.13,13.76 v38.99,13.91 39.12,13.78 42.04,13.78 42.16,13.65 R4.1 42.28,10.75 43.05,9.97 44.58,9.97 45.34,9.21 45.34,6.16 42.61,3.43 v40.39,3.43
N$1  (via drill 0.25)
  Top 0.203: v41.72,10.29 40.45,10.29 U4.14
  Bottom 0.203: U8.7 38.43,4.94 R1.2 41.26,4.94 41.72,5.4 v41.72,10.29
N$2
  Bottom 0.203: U2.5 34.42,9.72 33.72,9.02 31.24,9.02 C5.1
N$3  (via drill 0.25)
  Top 0.203: U4.56 v46.48,17.34
  Bottom 0.203: v46.48,17.34 46.48,16.33 C7.1
N$4
  Bottom 0.203: U2.3 31.11,11.62 30.86,11.37 30.27,11.37 C5.2
N$5  (via drill 0.25)
  Top 0.203: v44.77,2.29 YELLOW.C
  Bottom 0.203: v44.77,2.29 45.7,2.29 R5.1
N$6
  Top 0.406: U$1.P4 6.43,13.1 R28.1
N$7
  Top 0.203: 42.46,7.24 U4.17 42.12,6.86 38.86,6.86 38.35,6.35 38.35,5.05 JP6.1
N$8
  Bottom 0.203: R1.1 40.88,6.22 U8.6 36.07,6.22 35.32,5.48 R3.2
N$9
  Bottom 0.203: U8.1 33.2,3.67 | R3.1 34.02,2.88 U8.1 | U8.1 30.86,3.68 R2.2 C8.2
N$10
  Top 0.203: 42.99,7.21 U4.18 42.93,7.17 42.93,6.35 42.67,6.1 42.16,6.1 41.91,6.35 39.12,6.35 38.86,6.1 38.87,6.08 JP6.2
N$11  (via drill 0.25)
  Top 0.203: U5.28 29.69,8.41 v29.65,8.45
  Bottom 0.203: 33.2,4.97 U8.2 30.86,4.95 R2.1 C8.1 29.65,4.97 v29.65,8.45
N$12
  Top 0.203: U4.34 53.33,9.77 54.61,11.05 54.61,13.84 55.5,14.74 JP1.4
N$13  (via drill 0.25)
  Top 0.203: U4.33 53.84,9.27 55.12,10.54 55.12,12.95 v55.5,13.34 | v53.47,14.48 54.48,15.49 54.48,17.56 JP1.6
  Bottom 0.203: v55.5,13.34 54.61,13.34 v53.47,14.48
N$14  (via drill 0.25)
  Top 0.203: v44.77,4.57 RED.C
  Bottom 0.203: v44.77,4.57 45.7,4.57 R7.1
N$15  (via drill 0.25)
  Top 0.203: GREEN.C v44.77,3.43
  Bottom 0.203: v44.77,3.43 R6.1
N$16
  Top 0.203: U4.29 48.48,2.76 48.01,2.29 YELLOW.A
N$17
  Top 0.203: U4.28 47.98,3.65 47.75,3.43 GREEN.A
N$18
  Top 0.203: U4.27 47.48,4.82 RED.A
N$19
  Top 0.406: U$2.P4 14.37,17.7 R29.1
N$20
  Top 0.406: U$3.P4 18.97,9.76 R30.1
N$21
  Top 0.406: U$4.P4 11.03,5.16 R31.1
N$23
  Top 0.203: U7.1 59.63,16.26 60.26,16.89 61.34,16.89 61.53,17.08 U7.4 | U7.1 | U7.1 59.63,14.93 55.88,11.18 55.88,2.67 56.26,2.29 58.6,2.29 U6.28
N$25
  Top 0.406: U$5.P4 88.82,9.76 R32.1
N$26
  Top 0.406: U$6.P4 80.88,5.16 R33.1
N$27
  Top 0.406: U$7.P4 76.28,13.1 R34.1
N$28
  Top 0.406: U$8.P4 84.22,17.7 R35.1
N$30
  Top 0.203: R25.2 61.53,13.67 U7.3 61.56,15.18 62.61,15.18 63.12,15.68 R24.2
OSC1  (via drill 0.25)
  Top 0.203: 51.12,12.26 52.02,12.26 U4.39 50.49,12.27 v50.1,11.87 | v51.82,8.26 51.82,5.82 U3.3
  Bottom 0.203: v50.1,11.87 50.1,10.54 51.82,8.83 v51.82,8.26
OUT1  (via drill 0.25)
  Top 0.203: v65.6,17.21 JP5.1 | v57.09,8.38 57.3,8.16 U6.19
  Top 0.406: U$1.P1 3.73,13.1 R28.2 4.6,15.52 v9.65,20.57 | v69.6,17.27 67.82,17.27 JP5.1
  Bottom 0.203: R8.2 55.13,11.75 55.5,11.75 55.94,11.3 55.94,9.97 56.83,9.08 56.83,8.64 v57.09,8.38 57.28,8.19 59.63,8.19 59.88,8.45 59.88,9.59 59.31,10.16 59.31,13.53 61.47,15.68 63.44,15.68 64.96,17.21 v65.6,17.21
  Bottom 0.406: v9.65,20.57 24.13,20.57 24.89,21.34 66.04,21.34 69.6,17.78 v69.6,17.27
OUT2  (via drill 0.25)
  Top 0.203: v57.45,7.49 58.61,7.49 U6.20 | v65.6,16.19 JP5.2
  Top 0.406: U$2.P1 14.37,20.4 R29.2 16.48,19.53 v18.29,21.34 | v69.6,16.26 67.82,16.26 JP5.2
  Bottom 0.203: R9.2 55.13,10.54 55.5,10.54 55.5,9.78 56.39,8.89 56.39,8 56.9,7.49 v57.45,7.49 60.01,7.49 60.33,7.81 60.33,9.84 59.75,10.41 59.75,13.34 61.66,15.24 63.69,15.24 64.64,16.19 v65.6,16.19
  Bottom 0.406: v18.29,21.34 23.88,21.34 24.64,22.1 67.06,22.1 70.87,18.29 70.87,17.53 v69.6,16.26
OUT3  (via drill 0.25)
  Top 0.203: v56.73,6.86 U6.21 | JP5.3 67.56,15.37 v64.9,15.37
  Top 0.406: U$3.P1 21.67,9.76 | 21.67,9.76 R30.2 | 21.67,9.76 22.35,9.07 v22.35,8.38 | v70.61,15.24 70.55,15.18 JP5.3
  Bottom 0.203: R10.2 55.13,9.34 55.31,9.34 55.94,8.7 55.94,7.62 56.71,6.86 v56.73,6.86 60.52,6.86 60.77,7.11 60.77,10.03 60.2,10.6 60.2,13.14 61.85,14.8 63.94,14.8 64.52,15.37 v64.9,15.37
  Bottom 0.406: v22.35,8.38 24.38,6.35 24.38,2.29 25.91,0.76 70.61,0.76 71.37,1.52 71.37,14.48 v70.61,15.24
OUT4  (via drill 0.25)
  Top 0.203: v57.47,6.22 U6.22 | JP5.4 67.56,14.35 66.8,14.35 66.42,14.73 v65.6,14.73
  Top 0.406: R31.2 11.03,2.46 U$4.P1 12.19,2.42 12.19,1.52 12.95,0.76 68.83,0.76 70.1,2.03 v70.1,2.29 | v70.1,14.22 70.04,14.16 JP5.4
  Bottom 0.203: R11.2 55.13,8.13 55.24,8.13 55.5,7.87 55.5,7.37 55.94,6.92 55.94,6.41 56.13,6.22 v57.47,6.22 60.64,6.22 61.21,6.79 61.21,10.22 60.64,10.79 60.64,12.95 62.04,14.35 64.2,14.35 64.58,14.73 v65.6,14.73
  Bottom 0.406: v70.1,2.29 v70.1,14.22
OUT5  (via drill 0.25)
  Top 0.203: JP5.5 67.44,13.14 67.25,13.34 66.74,13.34 65.98,14.1 v64.9,14.1 | v56.77,5.52 58.59,5.52 U6.23
  Top 0.406: 91.17,9.41 91.52,9.76 U$5.P1 91.73,10.67 | 91.17,9.41 R32.2 | JP5.5 70.8,13.14 73.15,15.49 v80.52,15.49 | v92.2,8.64 91.43,9.41 91.17,9.41
  Bottom 0.203: R12.2 55.13,6.92 55.24,6.92 55.5,6.67 55.5,6.16 56.13,5.52 v56.77,5.52 61.34,5.52 61.66,5.84 61.66,10.41 61.09,10.99 61.09,12.76 62.23,13.91 64.71,13.91 v64.9,14.1
  Bottom 0.406: v92.2,8.64 85.34,15.49 v80.52,15.49
OUT6  (via drill 0.25)
  Top 0.203: v57.45,4.89 U6.24 | JP5.6 67.31,12.13 67.12,12.32 66.74,12.32 66.55,12.51 66.55,12.83 66.17,13.21 65.85,13.21 v65.6,13.46
  Top 0.406: U$6.P1 80.88,2.46 R33.2 79.98,3.3 77.72,3.3 v75.44,5.59 | v72.39,13.21 72.2,13.4 70.93,12.13 JP5.6
  Bottom 0.203: v65.6,13.46 62.42,13.46 61.53,12.57 61.53,11.18 62.1,10.6 62.1,5.27 61.72,4.89 v57.45,4.89 55.69,4.89 55.5,5.08 55.5,5.46 54.93,6.03 R13.2
  Bottom 0.406: v75.44,5.59 72.39,8.64 v72.39,13.21
OUT7  (via drill 0.25)
  Top 0.203: U6.25 58.64,4.25 59.44,4.25 59.63,4.45 61.91,4.45 62.55,5.08 62.55,10.79 61.98,11.37 61.98,12.38 62.61,13.02 64.14,13.02 64.39,12.76 65.85,12.76 66.04,12.57 66.04,12.32 66.55,11.81 66.55,11.56 66.8,11.3 67.56,11.3 JP5.7 | U6.25 58.61,4.25 | U6.25 v56.78,4.27 56.77,4.25
  Top 0.406: R34.2 73.58,13.1 U$7.P1 71.92,11.98 71.06,11.11 JP5.7
  Bottom 0.203: v56.78,4.27 55.49,4.27 54.93,4.83 R14.2
OUT8  (via drill 0.25)
  Top 0.203: JP5.8 67.56,10.29 66.86,10.29 66.55,10.6 66.55,10.92 66.1,11.37 66.1,11.62 65.41,12.32 64.14,12.32 63.88,12.57 62.8,12.57 62.42,12.19 62.42,11.56 62.99,10.99 62.99,4.64 62.36,4 59.82,4 59.43,3.62 U6.26 v57.47,3.62
  Top 0.406: U$8.P1 84.22,20.4 84.44,20.18 | 84.44,20.18 R35.2 | v75.18,8.38 72.39,8.38 70.67,10.1 JP5.8 | v85.09,21.08 84.44,20.43 84.44,20.18
  Bottom 0.203: R15.2 v57.47,3.62
  Bottom 0.406: v75.18,8.38 78.49,11.68 78.49,19.56 80.01,21.08 v85.09,21.08
OUT9  (via drill 0.25)
  Top 0.203: JP5.9 v66.42,9.08 66.16,8.82 U6.11
  Bottom 0.203: 66.04,9.08 v66.42,9.08 65.98,9.08 65.15,9.91 65.15,10.48 64.96,10.67 R16.2
OUT10  (via drill 0.25)
  Top 0.203: JP5.10 v66.42,8.06 66.32,8.16 U6.10
  Bottom 0.203: 66.04,8.06 v66.42,8.06 65.91,8.06 65.15,8.83 65.15,9.27 64.96,9.46 R17.2
OUT11  (via drill 0.25)
  Top 0.203: JP5.11 v66.42,7.05 65.95,7.52 U6.9
  Bottom 0.203: 66.04,7.05 v66.42,7.05 65.98,7.05 64.83,8.19 64.47,8.19 R18.2
OUT12  (via drill 0.25)
  Top 0.203: JP5.12 v66.42,6.03 65.59,6.87 U6.8
  Bottom 0.203: 66.04,6.03 v66.42,6.03 65.85,6.03 64.83,7.05 R19.2
OUT13  (via drill 0.25)
  Top 0.203: JP5.13 v66.42,5.02 66.29,5.02 65.09,6.21 U6.7
  Bottom 0.203: R20.2 64.9,5.84 65.72,5.02 v66.42,5.02
OUT14  (via drill 0.25)
  Top 0.203: JP5.14 v66.42,4 66.1,4 65.79,4.32 65.79,4.89 65.15,5.52 64.47,5.52 U6.6
  Bottom 0.203: v66.42,4 65.53,4 64.9,4.64 R21.2
OUT15  (via drill 0.25)
  Top 0.203: JP5.15 v66.42,2.98 65.66,2.98 65.34,3.3 65.34,4.7 65.12,4.92 U6.5
  Bottom 0.203: R22.2 65.22,3.43 65.66,2.98 v66.42,2.98
OUT16  (via drill 0.25)
  Top 0.203: JP5.16 v66.42,1.97 65.47,1.97 65.28,1.78 61.09,1.78 60.58,2.29 60.58,3.3 60.83,3.56 63.06,3.56 63.75,4.25 64.42,4.25 U6.4
  Bottom 0.203: R23.2 66.17,2.22 v66.42,1.97
VDD  (via drill 0.25)
  Top 0.203: R24.1 62.44,18.73 60.26,18.73 59.63,18.1 U7.5 59.63,18.09 58.8,18.92 56.9,18.92 v55.75,20.07 | C6.1 54.99,3.56 54.61,3.17 53.34,3.17 | 53.34,3.17 52.2,3.17 51.82,3.56 51.82,4.09 U3.4 | 46.22,9.27 46.23,9.27 | 43.5,9.27 43.48,9.25 U4.19 43.5,7.22 43.5,6.22 42.86,5.59 41.91,5.59 41.66,5.84 40.13,5.84 39.88,5.59 JP6.4 | 36.77,8.38 U5.1 | v38.16,12 38.16,11.24 37.72,10.79 37.72,8.41 | 36.83,8.38 36.83,5.97 v36.39,5.52 | U4.26 46.99,7.21 46.99,9.27 | 53.34,3.17 54.67,1.84 59.44,1.84 59.69,2.1 59.69,2.67 v59.94,2.92 | 41.85,17.4 42.04,17.59 45.78,17.59 45.98,17.78 U4.57 v45.97,20.32 | U4.38 51.07,11.77 49.28,9.97 | U4.10 41.96,12.27 42.42,11.81 | 42.42,9.27 42.42,11.81 | 42.42,11.81 43.12,11.81 v43.56,12.26 | U6.1 62.71,2.32 62.1,2.92 v61.21,2.92
  Top 0.305: U1.6 34.5,20.38 C2.1 39.1,20.14 41.85,17.4 49.28,9.97 | 36.83,8.38 36.77,8.38 | U3.4 51.76,4.06 51.24,4.06 50.55,4.76 50.55,8.7 49.28,9.97 | 49.28,9.97 48.57,9.27 46.99,9.27 46.22,9.27 43.5,9.27 42.42,9.27 U4.16 39.68,9.27 38.83,8.41 37.72,8.41 U5.1
  Bottom 0.203: C3.1 32.75,12.52 33.4,11.87 33.4,11.37 32.7,10.67 U2.2 | C3.1 32.75,12.81 32.64,12.7 | v38.16,12 38.16,12.38 36.64,13.91 33.15,13.91 32.77,13.53 32.77,12.97 C3.1 | v36.39,5.52 36.39,4.13 36.83,3.68 U8.8 | v55.75,20.07 52.83,20.07 52.2,20.7 46.35,20.7 v45.97,20.32 | v43.56,12.26 43.56,13.64 R4.2 | v59.94,2.92 v61.21,2.92
VSS
  Bottom 0.203: U2.1 32.83,9.72 33.47,10.35 35.56,10.35 35.88,10.03 36.56,10.03 C4.1 36.58,9.53 36.07,9.02 34.54,9.02 33.21,7.69 U8.4

### Text on the board
tPlace: SkinProc v0.1B | U.C. Berkeley | IN1 | OUT1 | J.Goldberg | Jan 2015